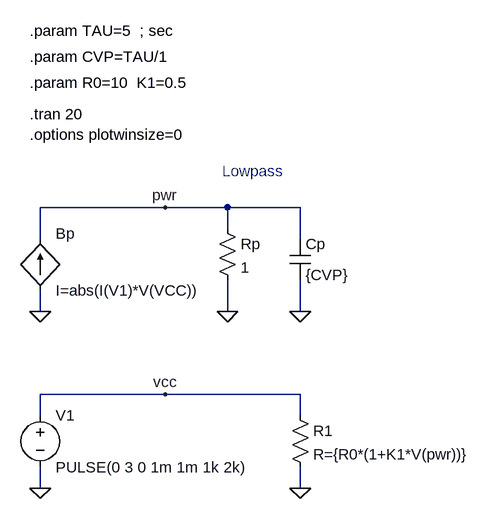
[diagram p0: schematic ResistorWithTimeConstant.asc]
ResistorWithTimeConstant.asc, the LTspice schematic file:
Version 4
SHEET 1 880 692
WIRE -96 288 -96 240
WIRE -96 400 -96 368
WIRE -96 560 -96 528
WIRE -96 672 -96 640
WIRE 96 240 -96 240
WIRE 96 528 -96 528
WIRE 192 240 96 240
WIRE 192 272 192 240
WIRE 192 400 192 352
WIRE 304 240 192 240
WIRE 304 288 304 240
WIRE 304 400 304 352
WIRE 304 528 96 528
WIRE 304 560 304 528
WIRE 304 672 304 640
FLAG 192 400 0
FLAG -96 400 0
FLAG 304 400 0
FLAG 304 672 0
FLAG -96 672 0
FLAG 96 240 pwr
FLAG 96 528 vcc
SYMBOL res 176 256 R0
SYMATTR InstName Rp
SYMATTR Value 1
SYMBOL bi -96 368 M180
WINDOW 0 24 88 Left 0
WINDOW 3 24 0 Left 0
SYMATTR InstName Bp
SYMATTR Value I=abs(I(V1)*V(VCC))
SYMBOL cap 288 288 R0
SYMATTR InstName Cp
SYMATTR Value {CVP}
SYMBOL voltage -96 544 R0
WINDOW 123 0 0 Left 0
WINDOW 39 0 0 Left 0
SYMATTR InstName V1
SYMATTR Value PULSE(0 3 0 1m 1m 1k 2k)
SYMBOL res 288 544 R0
SYMATTR InstName R1
SYMATTR Value R={R0*(1+K1*V(pwr))}
TEXT -112 8 Left 0 !.param CVP=TAU/1
TEXT -112 -32 Left 0 !.param TAU=5  ; sec
TEXT -112 48 Left 0 !.param R0=10  K1=0.5
TEXT -112 96 Left 0 !.tran 20
TEXT 184 184 Left 0 ;Lowpass
TEXT -112 128 Left 0 !.options plotwinsize=0

The netlist it stands for:
* ResistorWithTimeConstant.asc
Rp pwr 0 1
Bp 0 pwr I=abs(I(V1)*V(VCC))
Cp pwr 0 {CVP}
V1 vcc 0 PULSE(0 3 0 1m 1m 1k 2k)
R1 vcc 0 R={R0*(1+K1*V(pwr))}
.param CVP=TAU/1
.param TAU=5  ; sec
.param R0=10  K1=0.5
.tran 20
* Lowpass
.options plotwinsize=0
.backanno
.end